# Altium schematic sheet 01_MAIN.SchDoc: =GlobalProjectName
size 209 x 297 mm; CheckedBy: A_D; Author: A_D; SheetNumber: 1; SheetTotal: 3; PageSetup: Record=PageOptions|CenterHorizontal=True|CenterVertical=True|PrintScale=0.70|XCorrection=1.00|YCorrection=1.00|PrintKind=2|BorderSize=5000000|LeftOffset=9000|BottomOffset=10100|Orientation=2|PaperLength=11176|PaperWidth=8636|Scale=100|PaperSource=259|PrintQuality=-3|MediaType=1|DitherType=10|PrintScaleMode=1|PaperKind=A3|PaperIndex=8
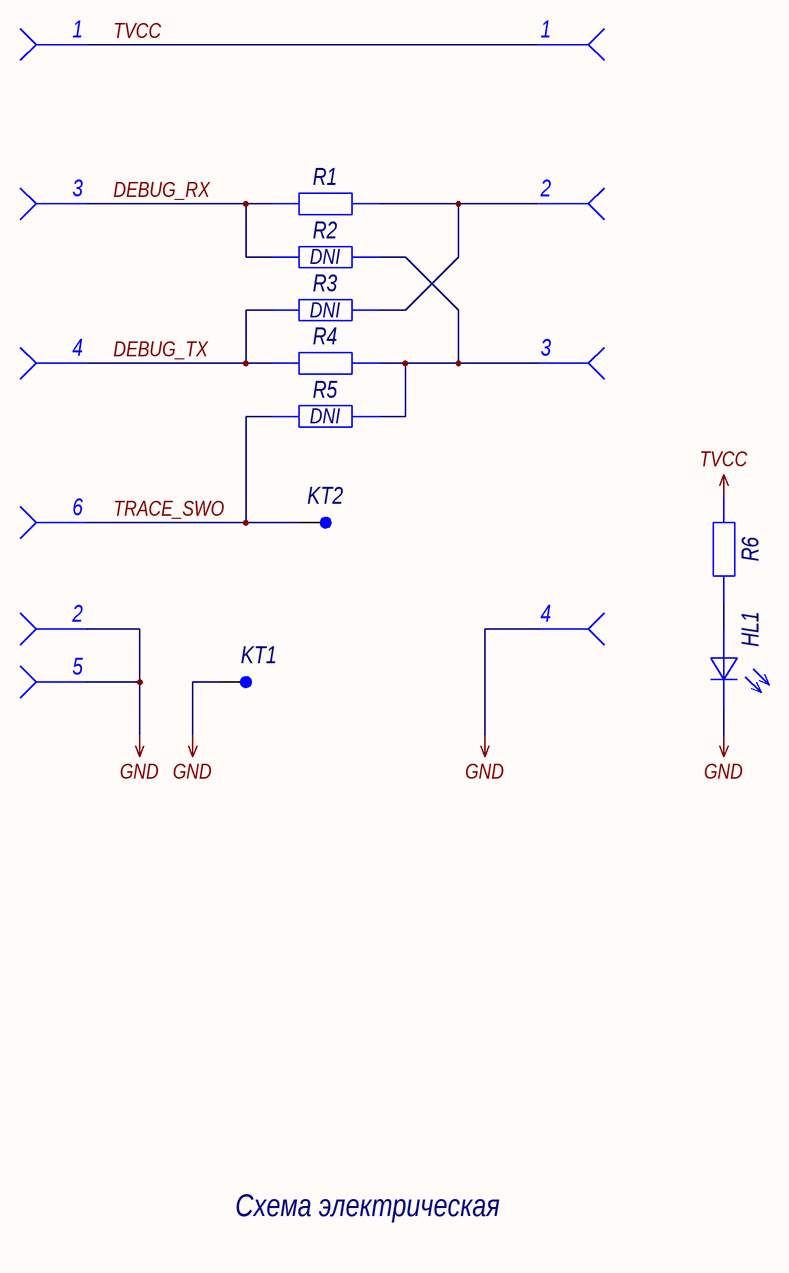
[diagram p0: 01_MAIN.SchDoc]

## Parts
HL1  TVCC  [LD0402_L]  (value not drawn)
KT1  Text  [TP-SMT-R-0.8mm]  (value not drawn)  (no BOM)
KT2  SWO  [TP-SMT-C-0.5mm]  (value not drawn)  (no BOM)
R1  Resistor  [R0402_L]  (value not drawn)
R2  Resistor  [R0402_L]  (value not drawn)  (no BOM)
R3  Resistor  [R0402_L]  (value not drawn)  (no BOM)
R4  Resistor  [R0402_L]  (value not drawn)
R5  Resistor  [R0402_L]  (value not drawn)  (no BOM)
R6  Resistor  [R0402_L]  (value not drawn)
XS1  DEBUG  [XF2M-0615-1A]  (value not drawn)  (parts A,B,C,D,E,F of 6)
XS2  PBS-4_S  [PBS-4]  (value not drawn)  (parts A,B,C,D of 4)

## Nets
GND: HL1.2(К) KT1.1 XS1.2 XS1.5 XS2.4
TVCC: R6.2 XS1.1 XS2.1
DEBUG_RX: R1.1 R2.1 XS1.3
DEBUG_TX: R3.1 R4.1 XS1.4
TRACE_SWO: KT2.1 R5.1 XS1.6
NetHL1_1: HL1.1(А) R6.1
NetR1_2: R1.2 R3.2 XS2.2
NetR2_2: R2.2 R4.2 R5.2 XS2.3

## Notes on the sheet
- (near R2) DNI
- (near R3) DNI
- (near R5) DNI
- Схема электрическая
  принципиальная
- Перв. примен.
- Справ. №
- Подп. и дата
- Инв. № дубл.
- Взам. инв. №
- Разраб.
- Изм.
- Лист
- № докум.
- Подп.
- Дата
- Литера
- Масса
- Масштаб
- Пров.
- Т.контр.
- Листов
- Инв. № подл.
- Н.контр.
- Утв.
- Форма 1 ГОСТ 2.104-2006
- Копировал
- Формат А4

## Library data of the parts
HL1 = KPHHS-1005QBC-D-V: Manufacturer: Kingbright; Type: Индикатор единичный; ID: 24; Forward Voltage: 3.3V; Forward Current: 20mA; Power Dissipation: 120mW; Luminous Flux: 60; Color: Blue; Leds: 1; Working Temperature Min: -40°С; Working Temperature Max: +85°С; Published: 03.12.2013; Publisher: Andrew Danich; Part Number: KPHHS-1005QBC-D-V; Value: KPHHS-1005QBC-D-V; Footprint: 0402; Application Category: 1
KT1 = TestPoint-SMT-GND: ID: 7; Application Type: On PCB Test Point; Application Category: 1; Published: 03.03.2015; Publisher: Andrew Danich; Part Number: TestPoint-SMT-GND; Value: TestPoint-SMT; Manufacturer: -; Functional Analog: -
KT2 = TestPoint-SMT: ID: 6; Application Type: On PCB Test Point; Application Category: 1; Published: 03.03.2015; Publisher: Andrew Danich; Part Number: TestPoint-SMT; Value: TestPoint-SMT; Manufacturer: -; Functional Analog: -
R1-R5 = RC0402JR-070RL: Manufacturer: Yageo; ID: 362; Value: 0; Limit Voltage: 50V; Tolerance: ±5%; Temperature Coefficient: 100ppm; Total Power Dissipation: 0.1W; Series Type: Thick-Film; Application Category: 1; Working Temperature Min: -55°С; Working Temperature Max: +155°С; Published: 24.03.2010; Publisher: Andrew Danich; Type: Резистор; Part Number: RC0402JR-070RL; Footprint: 0402
R6 = RC0402JR-0710KL: Manufacturer: Yageo; ID: 476; Value: 10k; Limit Voltage: 50V; Tolerance: ±5%; Temperature Coefficient: 100ppm; Total Power Dissipation: 0.1W; Series Type: Thick-Film; Application Category: 1; Working Temperature Min: -55°С; Working Temperature Max: +155°С; Published: 24.03.2010; Publisher: Andrew Danich; Type: Резистор; Part Number: RC0402JR-0710KL; Footprint: 0402
XS1 = XF2M-0615-1A: Manufacturer: Omron Electronics; ID: 6; Limit Voltage: 50V; Limit Current: 500mA; Connector Type: Female; Resistance: 0.05ohm; Pitch: 0.5mm; Application Category: 1; Working Temperature Min: -30°С; Working Temperature Max: +85°С; Published: 16.02.2017; Publisher: Viktor Klishin; Type: Розетка; Part Number: XF2M-0615-1A; Value: XF2M-0615-1A; Pins: 6; Series: FPC
XS2 = PBS-4_S: Value: PBS-4; Published: 07.09.2015; Publisher: Andrew Danich; Type: Розетка